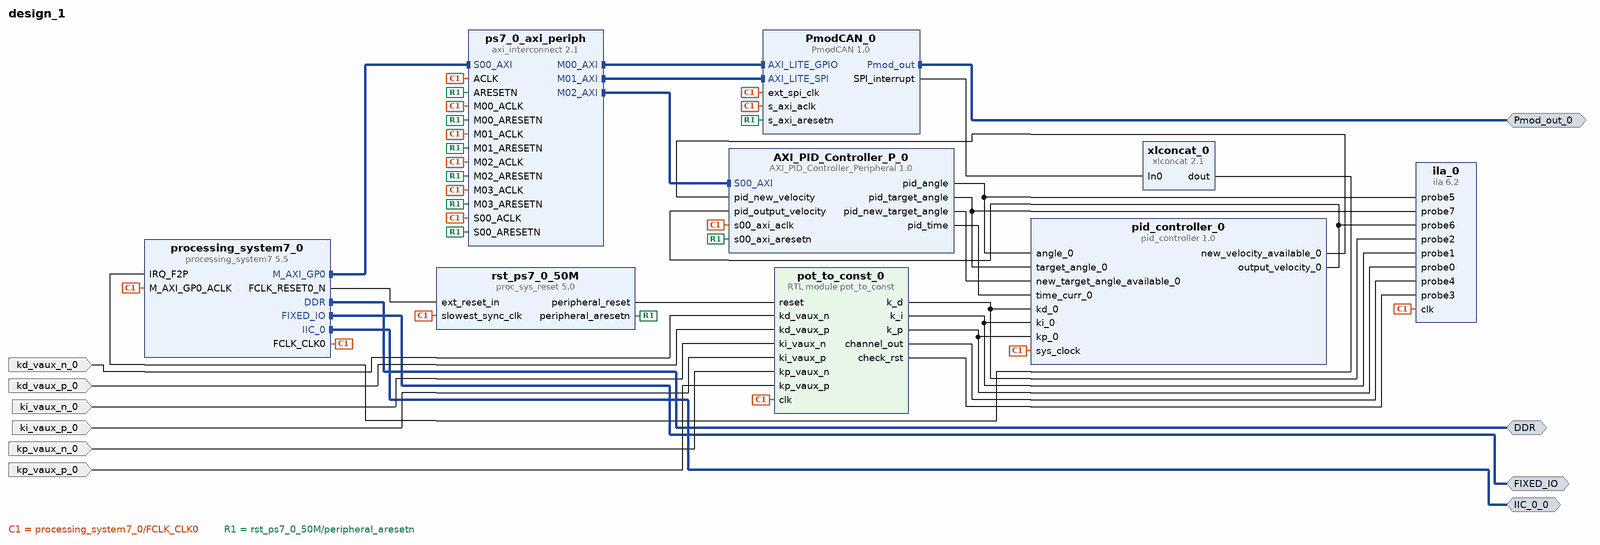
[diagram p0: block diagram of the top level]
# Vivado block design design_1, xc7z020clg400-1, Vivado 2021.1
create_bd_design design_1

create_bd_intf_port -mode Master -vlnv xilinx.com:interface:ddrx_rtl:1.0 DDR
create_bd_intf_port -mode Master -vlnv xilinx.com:display_processing_system7:fixedio_rtl:1.0 FIXED_IO
create_bd_intf_port -mode Master -vlnv digilentinc.com:interface:pmod_rtl:1.0 Pmod_out_0
create_bd_intf_port -mode Master -vlnv xilinx.com:interface:iic_rtl:1.0 IIC_0_0
create_bd_port -dir I kp_vaux_p_0
create_bd_port -dir I kp_vaux_n_0
create_bd_port -dir I ki_vaux_p_0
create_bd_port -dir I ki_vaux_n_0
create_bd_port -dir I kd_vaux_p_0
create_bd_port -dir I kd_vaux_n_0

create_bd_cell -type ip -vlnv xilinx.com:ip:processing_system7:5.5 processing_system7_0
set_property -dict [list \
  CONFIG.PCW_APU_PERIPHERAL_FREQMHZ 666.666666 \
  CONFIG.PCW_ENET0_ENET0_IO {MIO 16 .. 27} \
  CONFIG.PCW_ENET0_GRP_MDIO_ENABLE 1 \
  CONFIG.PCW_ENET0_GRP_MDIO_IO {MIO 52 .. 53} \
  CONFIG.PCW_ENET0_PERIPHERAL_ENABLE 1 \
  CONFIG.PCW_ENET0_RESET_ENABLE 0 \
  CONFIG.PCW_ENET_RESET_ENABLE 1 \
  CONFIG.PCW_ENET_RESET_SELECT {Share reset pin} \
  CONFIG.PCW_GPIO_MIO_GPIO_ENABLE 1 \
  CONFIG.PCW_GPIO_MIO_GPIO_IO MIO \
  CONFIG.PCW_I2C0_I2C0_IO EMIO \
  CONFIG.PCW_I2C0_PERIPHERAL_ENABLE 1 \
  CONFIG.PCW_I2C_PERIPHERAL_FREQMHZ 111.111115 \
  CONFIG.PCW_I2C_RESET_ENABLE 1 \
  CONFIG.PCW_I2C_RESET_SELECT {Share reset pin} \
  CONFIG.PCW_IRQ_F2P_INTR 1 \
  CONFIG.PCW_PRESET_BANK1_VOLTAGE {LVCMOS 1.8V} \
  CONFIG.PCW_QSPI_GRP_FBCLK_ENABLE 1 \
  CONFIG.PCW_QSPI_GRP_FBCLK_IO {MIO 8} \
  CONFIG.PCW_QSPI_GRP_SINGLE_SS_ENABLE 1 \
  CONFIG.PCW_QSPI_GRP_SINGLE_SS_IO {MIO 1 .. 6} \
  CONFIG.PCW_QSPI_PERIPHERAL_ENABLE 1 \
  CONFIG.PCW_QSPI_QSPI_IO {MIO 1 .. 6} \
  CONFIG.PCW_SD0_GRP_CD_ENABLE 1 \
  CONFIG.PCW_SD0_GRP_CD_IO {MIO 47} \
  CONFIG.PCW_SD0_GRP_WP_ENABLE 0 \
  CONFIG.PCW_SD0_PERIPHERAL_ENABLE 1 \
  CONFIG.PCW_SD0_SD0_IO {MIO 40 .. 45} \
  CONFIG.PCW_SDIO_PERIPHERAL_FREQMHZ 50 \
  CONFIG.PCW_SINGLE_QSPI_DATA_MODE x4 \
  CONFIG.PCW_UART1_PERIPHERAL_ENABLE 1 \
  CONFIG.PCW_UART1_UART1_IO {MIO 48 .. 49} \
  CONFIG.PCW_UART_PERIPHERAL_FREQMHZ 100 \
  CONFIG.PCW_UIPARAM_DDR_FREQ_MHZ 533.333333 \
  CONFIG.PCW_UIPARAM_DDR_MEMORY_TYPE {DDR 3 (Low Voltage)} \
  CONFIG.PCW_UIPARAM_DDR_PARTNO {MT41K256M16 RE-125} \
  CONFIG.PCW_USB0_PERIPHERAL_ENABLE 1 \
  CONFIG.PCW_USB0_RESET_ENABLE 1 \
  CONFIG.PCW_USB0_RESET_IO {MIO 46} \
  CONFIG.PCW_USB0_USB0_IO {MIO 28 .. 39} \
  CONFIG.PCW_USB_RESET_ENABLE 1 \
  CONFIG.PCW_USB_RESET_SELECT {Share reset pin} \
  CONFIG.PCW_USE_FABRIC_INTERRUPT 1 \
] [get_bd_cells processing_system7_0]
# 299 more settings of processing_system7_0 are not shown: defaults, MIO pin electricals, DDR timing, and values the tool derives
create_bd_cell -type ip -vlnv xilinx.com:ip:axi_interconnect:2.1 ps7_0_axi_periph
set_property -dict {CONFIG.NUM_MI 4} [get_bd_cells ps7_0_axi_periph]
create_bd_cell -type ip -vlnv xilinx.com:ip:proc_sys_reset:5.0 rst_ps7_0_50M
set_property -dict {CONFIG.C_AUX_RESET_HIGH 0} [get_bd_cells rst_ps7_0_50M]
create_bd_cell -type ip -vlnv digilentinc.com:IP:PmodCAN:1.0 PmodCAN_0
create_bd_cell -type ip -vlnv xilinx.com:ip:xlconcat:2.1 xlconcat_0
set_property -dict {CONFIG.NUM_PORTS 1} [get_bd_cells xlconcat_0]
create_bd_cell -type ip -vlnv xilinx.com:ip:ila:6.2 ila_0
set_property -dict [list \
  CONFIG.C_ENABLE_ILA_AXI_MON false \
  CONFIG.C_MONITOR_TYPE Native \
  CONFIG.C_NUM_OF_PROBES 8 \
  CONFIG.C_PROBE0_WIDTH 12 \
  CONFIG.C_PROBE1_WIDTH 12 \
  CONFIG.C_PROBE2_WIDTH 12 \
  CONFIG.C_PROBE4_WIDTH 5 \
  CONFIG.C_PROBE5_WIDTH 32 \
  CONFIG.C_PROBE6_WIDTH 32 \
  CONFIG.C_PROBE7_WIDTH 32 \
] [get_bd_cells ila_0]
create_bd_cell -type module -reference pot_to_const pot_to_const_0
create_bd_cell -type ip -vlnv user.org:user:AXI_PID_Controller_Peripheral:1.0 AXI_PID_Controller_P_0
create_bd_cell -type ip -vlnv saman:user:pid_controller:1.0 pid_controller_0

# ---- connections ----

connect_bd_intf_net [get_bd_intf_ports Pmod_out_0] [get_bd_intf_pins PmodCAN_0/Pmod_out]
connect_bd_intf_net [get_bd_intf_ports DDR] [get_bd_intf_pins processing_system7_0/DDR]
connect_bd_intf_net [get_bd_intf_ports FIXED_IO] [get_bd_intf_pins processing_system7_0/FIXED_IO]
connect_bd_intf_net [get_bd_intf_ports IIC_0_0] [get_bd_intf_pins processing_system7_0/IIC_0]
connect_bd_intf_net [get_bd_intf_pins processing_system7_0/M_AXI_GP0] [get_bd_intf_pins ps7_0_axi_periph/S00_AXI]
connect_bd_intf_net [get_bd_intf_pins ps7_0_axi_periph/M00_AXI] [get_bd_intf_pins PmodCAN_0/AXI_LITE_GPIO]
connect_bd_intf_net [get_bd_intf_pins ps7_0_axi_periph/M01_AXI] [get_bd_intf_pins PmodCAN_0/AXI_LITE_SPI]
connect_bd_intf_net [get_bd_intf_pins ps7_0_axi_periph/M02_AXI] [get_bd_intf_pins AXI_PID_Controller_P_0/S00_AXI]
connect_bd_net [get_bd_pins AXI_PID_Controller_P_0/pid_angle] [get_bd_pins ila_0/probe5] [get_bd_pins pid_controller_0/angle_0]
connect_bd_net [get_bd_pins AXI_PID_Controller_P_0/pid_new_target_angle] [get_bd_pins pid_controller_0/new_target_angle_available_0]
connect_bd_net [get_bd_pins AXI_PID_Controller_P_0/pid_target_angle] [get_bd_pins ila_0/probe7] [get_bd_pins pid_controller_0/target_angle_0]
connect_bd_net [get_bd_pins AXI_PID_Controller_P_0/pid_time] [get_bd_pins pid_controller_0/time_curr_0]
connect_bd_net [get_bd_pins PmodCAN_0/SPI_interrupt] [get_bd_pins xlconcat_0/In0]
connect_bd_net -net kd_vaux_n_0_1 [get_bd_ports kd_vaux_n_0] [get_bd_pins pot_to_const_0/kd_vaux_n]
connect_bd_net -net kd_vaux_p_0_1 [get_bd_ports kd_vaux_p_0] [get_bd_pins pot_to_const_0/kd_vaux_p]
connect_bd_net -net ki_vaux_n_0_1 [get_bd_ports ki_vaux_n_0] [get_bd_pins pot_to_const_0/ki_vaux_n]
connect_bd_net -net ki_vaux_p_0_1 [get_bd_ports ki_vaux_p_0] [get_bd_pins pot_to_const_0/ki_vaux_p]
connect_bd_net -net kp_vaux_n_0_1 [get_bd_ports kp_vaux_n_0] [get_bd_pins pot_to_const_0/kp_vaux_n]
connect_bd_net -net kp_vaux_p_0_1 [get_bd_ports kp_vaux_p_0] [get_bd_pins pot_to_const_0/kp_vaux_p]
connect_bd_net [get_bd_pins pid_controller_0/new_velocity_available_0] [get_bd_pins AXI_PID_Controller_P_0/pid_new_velocity]
connect_bd_net [get_bd_pins pid_controller_0/output_velocity_0] [get_bd_pins AXI_PID_Controller_P_0/pid_output_velocity] [get_bd_pins ila_0/probe6]
connect_bd_net [get_bd_pins pot_to_const_0/channel_out] [get_bd_pins ila_0/probe4]
connect_bd_net [get_bd_pins pot_to_const_0/check_rst] [get_bd_pins ila_0/probe3]
connect_bd_net [get_bd_pins pot_to_const_0/k_d] [get_bd_pins ila_0/probe2] [get_bd_pins pid_controller_0/kd_0]
connect_bd_net [get_bd_pins pot_to_const_0/k_i] [get_bd_pins ila_0/probe1] [get_bd_pins pid_controller_0/ki_0]
connect_bd_net [get_bd_pins pot_to_const_0/k_p] [get_bd_pins ila_0/probe0] [get_bd_pins pid_controller_0/kp_0]
connect_bd_net [get_bd_pins processing_system7_0/FCLK_CLK0] \
  [get_bd_pins processing_system7_0/M_AXI_GP0_ACLK] [get_bd_pins ps7_0_axi_periph/S00_ACLK] \
  [get_bd_pins rst_ps7_0_50M/slowest_sync_clk] [get_bd_pins ps7_0_axi_periph/M00_ACLK] [get_bd_pins ps7_0_axi_periph/ACLK] \
  [get_bd_pins PmodCAN_0/s_axi_aclk] [get_bd_pins ps7_0_axi_periph/M01_ACLK] [get_bd_pins PmodCAN_0/ext_spi_clk] \
  [get_bd_pins ps7_0_axi_periph/M02_ACLK] [get_bd_pins ps7_0_axi_periph/M03_ACLK] [get_bd_pins ila_0/clk] \
  [get_bd_pins pot_to_const_0/clk] [get_bd_pins AXI_PID_Controller_P_0/s00_axi_aclk] [get_bd_pins pid_controller_0/sys_clock]
connect_bd_net [get_bd_pins processing_system7_0/FCLK_RESET0_N] [get_bd_pins rst_ps7_0_50M/ext_reset_in]
connect_bd_net [get_bd_pins rst_ps7_0_50M/peripheral_aresetn] \
  [get_bd_pins ps7_0_axi_periph/S00_ARESETN] [get_bd_pins ps7_0_axi_periph/M00_ARESETN] \
  [get_bd_pins ps7_0_axi_periph/ARESETN] [get_bd_pins PmodCAN_0/s_axi_aresetn] [get_bd_pins ps7_0_axi_periph/M01_ARESETN] \
  [get_bd_pins ps7_0_axi_periph/M02_ARESETN] [get_bd_pins ps7_0_axi_periph/M03_ARESETN] \
  [get_bd_pins AXI_PID_Controller_P_0/s00_axi_aresetn]
connect_bd_net [get_bd_pins rst_ps7_0_50M/peripheral_reset] [get_bd_pins pot_to_const_0/reset]
connect_bd_net [get_bd_pins xlconcat_0/dout] [get_bd_pins processing_system7_0/IRQ_F2P]

# ---- address map ----
assign_bd_address -offset 0x40000000 -range 4K -target_address_space [get_bd_addr_spaces processing_system7_0/Data] [get_bd_addr_segs PmodCAN_0/AXI_LITE_GPIO/Reg0]
assign_bd_address -offset 0x40010000 -range 64K -target_address_space [get_bd_addr_spaces processing_system7_0/Data] [get_bd_addr_segs PmodCAN_0/AXI_LITE_SPI/Reg0]
assign_bd_address -offset 0x43C00000 -range 64K -target_address_space [get_bd_addr_spaces processing_system7_0/Data] [get_bd_addr_segs AXI_PID_Controller_P_0/S00_AXI/S00_AXI_reg]

validate_bd_design
save_bd_design
